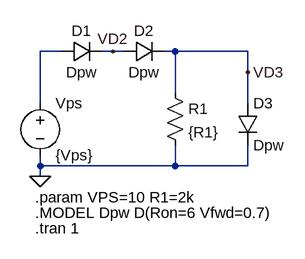
[diagram p0: schematic 6-9-b-1.asc]
6-9-b-1.asc, the LTspice schematic file:
Version 4
SHEET 1 880 680
WIRE 128 80 96 80
WIRE 208 80 192 80
WIRE 224 80 208 80
WIRE 304 80 288 80
WIRE 416 80 304 80
WIRE 416 112 416 80
WIRE 304 144 304 80
WIRE 96 160 96 80
WIRE 416 160 416 112
WIRE 96 256 96 240
WIRE 304 256 304 224
WIRE 304 256 96 256
WIRE 416 256 416 224
WIRE 416 256 304 256
WIRE 96 272 96 256
FLAG 96 272 0
FLAG 208 80 VD2
FLAG 416 112 VD3
SYMBOL voltage 96 144 R0
SYMATTR InstName Vps
SYMATTR Value {Vps}
SYMBOL diode 128 96 R270
WINDOW 0 32 32 VTop 2
WINDOW 3 0 32 VBottom 2
SYMATTR InstName D1
SYMATTR Value Dpw
SYMBOL diode 224 96 R270
WINDOW 0 32 32 VTop 2
WINDOW 3 0 32 VBottom 2
SYMATTR InstName D2
SYMATTR Value Dpw
SYMBOL res 288 128 R0
SYMATTR InstName R1
SYMATTR Value {R1}
SYMBOL diode 400 160 R0
SYMATTR InstName D3
SYMATTR Value Dpw
TEXT 88 304 Left 2 !.param VPS=10 R1=2k
TEXT 88 328 Left 2 !.MODEL Dpw D(Ron=6 Vfwd=0.7)
TEXT 88 352 Left 2 !.tran 1

The netlist it stands for:
* 6-9-b-1.asc
Vps N001 0 {Vps}
D1 N001 VD2 Dpw
D2 VD2 VD3 Dpw
R1 VD3 0 {R1}
D3 VD3 0 Dpw
.model D D
.lib standard.dio
.param VPS=10 R1=2k
.MODEL Dpw D(Ron=6 Vfwd=0.7)
.tran 1
.backanno
.end